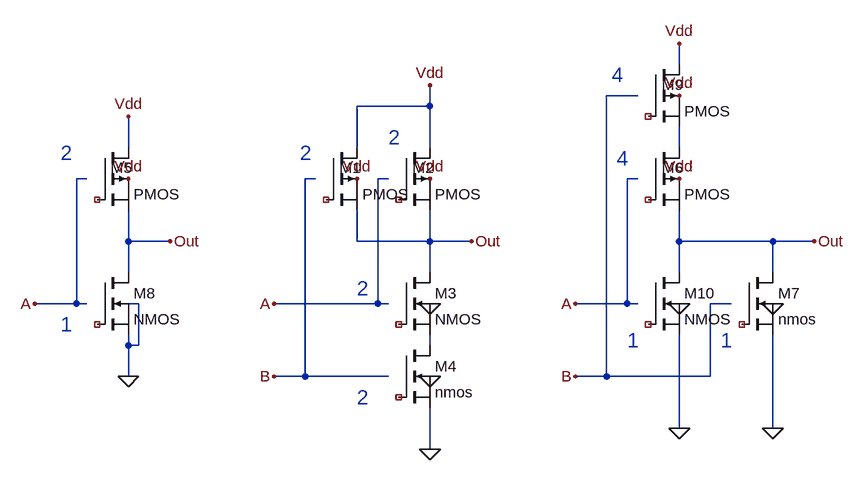
[diagram p0: schematic sizing_fig.asc]
sizing_fig.asc, the LTspice schematic file:
Version 4
SHEET 1 1292 680
WIRE -800 -480 -800 -512
WIRE -864 -432 -912 -432
WIRE -1184 -416 -1184 -448
WIRE -1184 -416 -1296 -416
WIRE -1648 -352 -1648 -400
WIRE -1296 -352 -1296 -416
WIRE -1184 -352 -1184 -416
WIRE -800 -352 -800 -384
WIRE -1712 -304 -1728 -304
WIRE -1360 -304 -1376 -304
WIRE -1248 -304 -1264 -304
WIRE -864 -304 -880 -304
WIRE -1648 -208 -1648 -256
WIRE -1584 -208 -1648 -208
WIRE -1296 -208 -1296 -256
WIRE -1184 -208 -1184 -256
WIRE -1184 -208 -1296 -208
WIRE -1120 -208 -1184 -208
WIRE -800 -208 -800 -256
WIRE -656 -208 -800 -208
WIRE -592 -208 -656 -208
WIRE -1648 -160 -1648 -208
WIRE -1184 -160 -1184 -208
WIRE -800 -160 -800 -208
WIRE -656 -160 -656 -208
WIRE -1728 -112 -1728 -304
WIRE -1728 -112 -1792 -112
WIRE -1712 -112 -1728 -112
WIRE -1632 -112 -1648 -112
WIRE -1264 -112 -1264 -304
WIRE -1264 -112 -1424 -112
WIRE -1248 -112 -1264 -112
WIRE -880 -112 -880 -304
WIRE -880 -112 -960 -112
WIRE -864 -112 -880 -112
WIRE -720 -112 -752 -112
WIRE -1648 -48 -1648 -64
WIRE -1632 -48 -1632 -112
WIRE -1632 -48 -1648 -48
WIRE -1184 -48 -1184 -64
WIRE -1648 0 -1648 -48
WIRE -1376 0 -1376 -304
WIRE -1376 0 -1424 0
WIRE -1248 0 -1376 0
WIRE -912 0 -912 -432
WIRE -912 0 -960 0
WIRE -752 0 -752 -112
WIRE -752 0 -912 0
WIRE -800 80 -800 -64
WIRE -656 80 -656 -64
WIRE -1184 112 -1184 48
FLAG -1184 112 0
FLAG -1120 -208 Out
FLAG -1184 -448 Vdd
FLAG -1424 -112 A
FLAG -1424 0 B
FLAG -1648 0 0
FLAG -1584 -208 Out
FLAG -1648 -400 Vdd
FLAG -1792 -112 A
FLAG -800 80 0
FLAG -592 -208 Out
FLAG -960 -112 A
FLAG -960 0 B
FLAG -800 -304 Vdd
FLAG -800 -432 Vdd
FLAG -1184 -304 Vdd
FLAG -1296 -304 Vdd
FLAG -1648 -304 Vdd
FLAG -800 -512 Vdd
FLAG -1184 0 0
FLAG -1184 -112 0
FLAG -656 -112 0
FLAG -800 -112 0
FLAG -656 80 0
SYMBOL pmos -1232 -352 R0
WINDOW 0 21 31 Left 2
SYMATTR InstName M2
SYMATTR Value2 l=0.6u w=3u
SYMBOL nmos -1232 -48 R0
SYMATTR InstName M4
SYMATTR Value2 l=0.6u w=3u
SYMATTR Value nmos
SYMBOL pmos -1344 -352 R0
WINDOW 0 21 31 Left 2
SYMATTR InstName M1
SYMATTR Value2 l=0.6u w=3u
SYMATTR SpiceModel ""
SYMATTR Value PMOS
SYMBOL nmos -1232 -160 R0
SYMATTR InstName M3
SYMATTR Value2 l=0.6u w=3u
SYMATTR Value NMOS
SYMBOL pmos -1696 -352 R0
WINDOW 0 21 31 Left 2
SYMATTR InstName M5
SYMATTR Value2 l=0.6u w=3u
SYMBOL nmos -1696 -160 R0
SYMATTR InstName M8
SYMATTR Value2 l=0.6u w=3u
SYMATTR Value NMOS
SYMBOL pmos -848 -352 R0
WINDOW 0 21 31 Left 2
SYMATTR InstName M6
SYMATTR Value2 l=0.6u w=3u
SYMBOL nmos -704 -160 R0
SYMATTR InstName M7
SYMATTR Value2 l=0.6u w=3u
SYMATTR Value nmos
SYMBOL pmos -848 -480 R0
WINDOW 0 21 31 Left 2
SYMATTR InstName M9
SYMATTR Value2 l=0.6u w=3u
SYMATTR SpiceModel ""
SYMATTR Value PMOS
SYMBOL nmos -848 -160 R0
SYMATTR InstName M10
SYMATTR Value2 l=0.6u w=3u
SYMATTR Value NMOS
TEXT -1752 -80 Left 3 ;1
TEXT -1752 -344 Left 3 ;2
TEXT -1296 32 Left 3 ;2
TEXT -1296 -136 Left 3 ;2
TEXT -1384 -344 Left 3 ;2
TEXT -1248 -368 Left 3 ;2
TEXT -880 -56 Left 3 ;1
TEXT -736 -56 Left 3 ;1
TEXT -896 -336 Left 3 ;4
TEXT -904 -464 Left 3 ;4

The netlist it stands for:
* sizing_fig.asc
* M2: PMOS l=0.6u w=3u (symbol pmos not certain, pin order unknown); nets seen at it: Out, Vdd
* M4: nmos l=0.6u w=3u (symbol nmos not certain, pin order unknown); nets seen at it: 0, N002
* M1: PMOS l=0.6u w=3u (symbol pmos not certain, pin order unknown); nets seen at it: Out, Vdd
* M3: NMOS l=0.6u w=3u (symbol nmos not certain, pin order unknown); nets seen at it: N002, Out
* M5: PMOS l=0.6u w=3u (symbol pmos not certain, pin order unknown); nets seen at it: Out, Vdd
* M8: NMOS l=0.6u w=3u (symbol nmos not certain, pin order unknown); nets seen at it: 0, Out
* M6: PMOS l=0.6u w=3u (symbol pmos not certain, pin order unknown); nets seen at it: N001, Out
* M7: nmos l=0.6u w=3u (symbol nmos not certain, pin order unknown); nets seen at it: 0, Out
* M9: PMOS l=0.6u w=3u (symbol pmos not certain, pin order unknown); nets seen at it: N001, Vdd
* M10: NMOS l=0.6u w=3u (symbol nmos not certain, pin order unknown); nets seen at it: 0, Out
* 1
* 2
* 2
* 2
* 2
* 2
* 1
* 1
* 4
* 4
.backanno
.end